# Altium schematic sheet Spi_Flash.SchDoc
size 127 x 127 mm; SheetNumber: 6; SheetTotal: 8
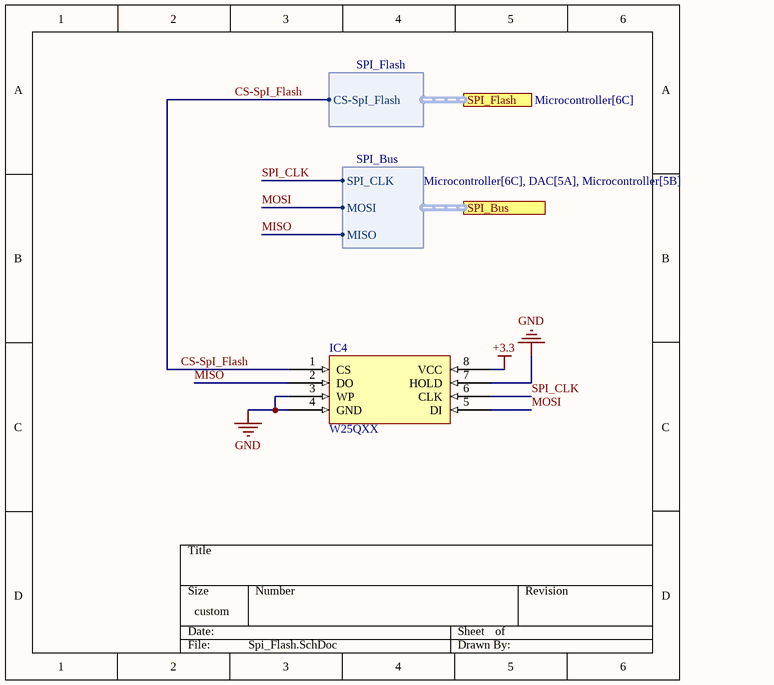
[diagram p0: Spi_Flash.SchDoc]

## Parts
IC4  W25QXX  [SOIC-8PIN-280MIL]

## Ports
SPI_Bus (harness SPI_Bus, see Microcontroller[6C], DAC[5A], Microcontroller[5B]), SPI_Flash (harness SPI_Flash, see Microcontroller[6C])

## Harnesses
SPI_Flash: CS-SpI_Flash
SPI_Bus: SPI_CLK, MOSI, MISO

## Nets
+3.3: IC4.8(VCC)
GND: IC4.3(WP) IC4.4(GND) IC4.7(HOLD)
CS-SpI_Flash: IC4.1(CS) ; port SPI_Flash.CS-SpI_Flash
MISO: IC4.2(DO) ; port SPI_Bus.MISO
MOSI: IC4.5(DI) ; port SPI_Bus.MOSI
SPI_CLK: IC4.6(CLK) ; port SPI_Bus.SPI_CLK